# Altium schematic sheet Processor.SchDoc
size A4
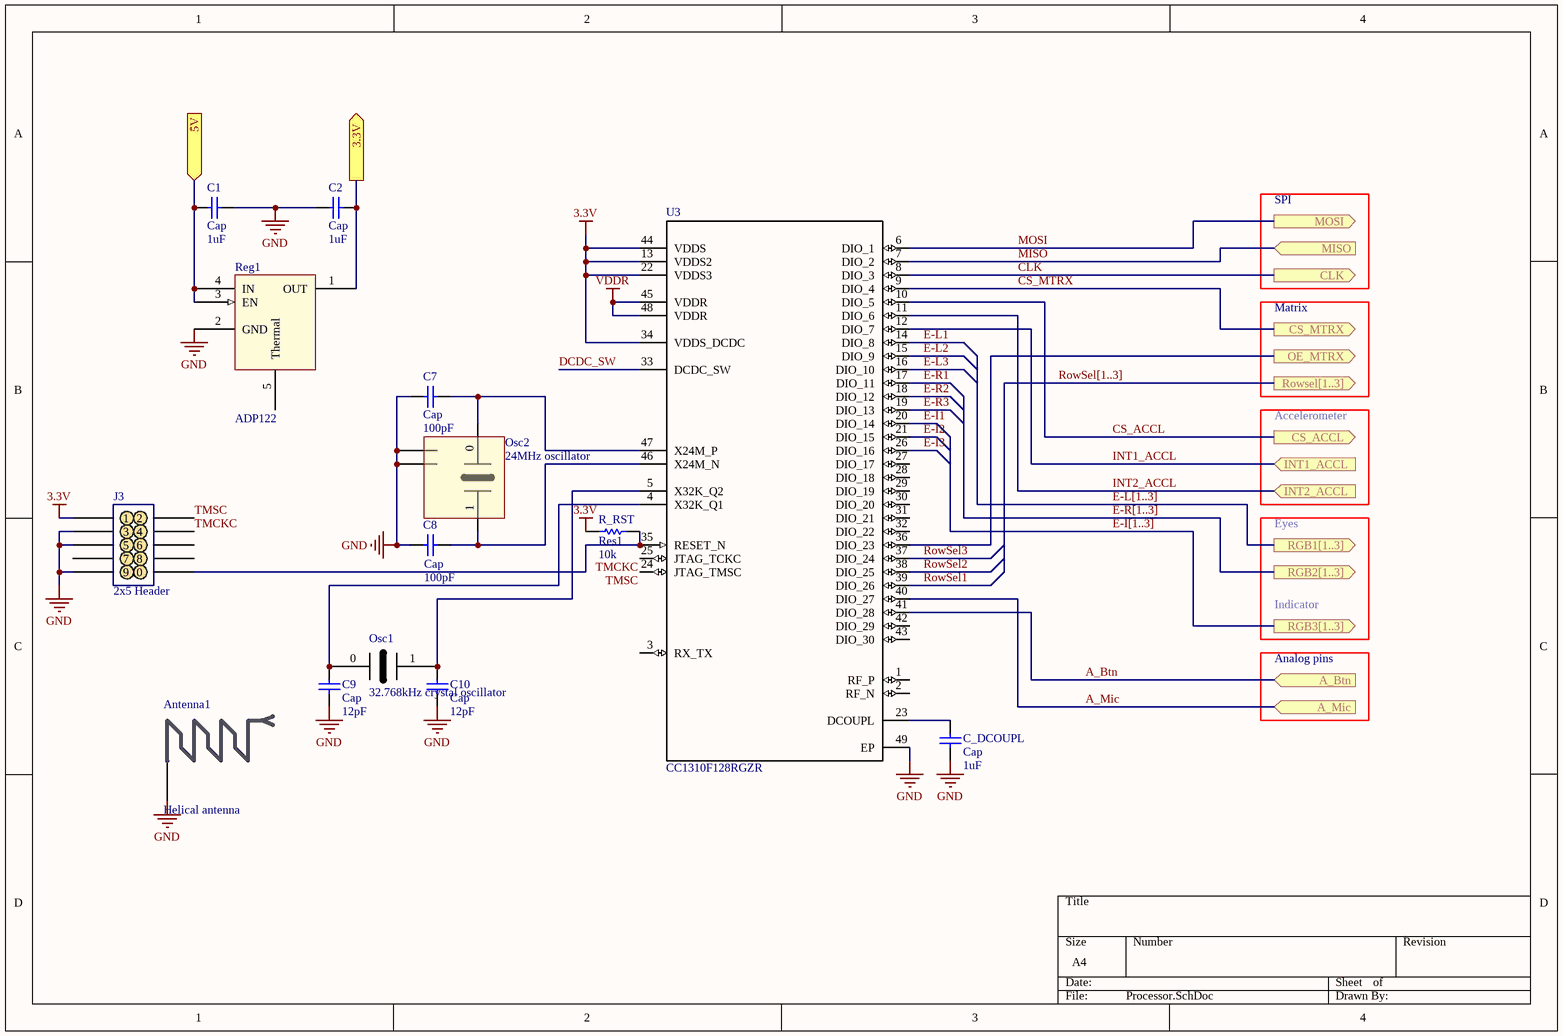
[diagram p0: Processor.SchDoc]

## Parts
Antenna1  Helical antenna  [ANTENNA_HELICAL]
C1  Cap  value 1uF  [6-0805_M]
C2  Cap  value 1uF  [6-0805_M]
C7  Cap  value 100pF  [6-0805_M]
C8  Cap  value 100pF  [6-0805_M]
C9  Cap  value 12pF  [6-0805_M]
C10  Cap  value 12pF  [6-0805_M]
C_DCOUPL  Cap  value 1uF  [6-0805_M]
J3  2x5 Header  [2x5_1.27mm]
Osc1  32.768kHz crystal oscillator  [32kHz_osc]
Osc2  24MHz oscillator  [24MHz_Osc]
R_RST  Res1  value 10k  [6-0805_M]
Reg1  ADP122  [SOP5]
U3  CC1310F128RGZR  [CC1310RGZ]

## Ports
3.3V (out), 5V (in), A_Btn (in), A_Mic (in), CLK (out), CS_ACCL (out), CS_MTRX (out), INT1_ACCL (in), INT2_ACCL (in), MISO (in), MOSI (out), OE_MTRX (out), RGB1[1..3] (out), RGB2[1..3] (out), RGB3[1..3] (out), Rowsel[1..3] (out)

## Nets
3.3V: J3.1 R_RST.1 U3.13(VDDS2) U3.22(VDDS3) U3.34(VDDS_DCDC) U3.44(VDDS)
GND: Antenna1.0(CON) C1.1 C2.2 C7.2 C8.1 C9.1 C10.1 C_DCOUPL.1 J3.3 J3.5 J3.9 Osc2.2 Osc2.3 Reg1.2(GND) U3.49(EP)
VDDR: U3.45(VDDR) U3.48(VDDR)
3.3V: C2.1 Reg1.1(OUT) ; port 3.3V  [a separate net that carries the same name]
5V: C1.2 Reg1.3(EN) Reg1.4(IN) ; port 5V
A_Btn: U3.41(DIO_28) ; port A_Btn
A_Mic: U3.40(DIO_27) ; port A_Mic
CLK: U3.8(DIO_3) ; port CLK
CS_ACCL: U3.10(DIO_5) ; port CS_ACCL
CS_MTRX: U3.9(DIO_4) ; port CS_MTRX
DCDC_SW: U3.33(DCDC_SW)
E-I1: U3.20(DIO_14)
E-I2: U3.21(DIO_15)
E-I3: U3.26(DIO_16)
E-L1: U3.14(DIO_8)
E-L2: U3.15(DIO_9)
E-L3: U3.16(DIO_10)
E-R1: U3.17(DIO_11)
E-R2: U3.18(DIO_12)
E-R3: U3.19(DIO_13)
INT1_ACCL: U3.12(DIO_7) ; port INT1_ACCL
INT2_ACCL: U3.11(DIO_6) ; port INT2_ACCL
MISO: U3.7(DIO_2) ; port MISO
MOSI: U3.6(DIO_1) ; port MOSI
OE_MTRX: U3.36(DIO_23) ; port OE_MTRX
RowSel1: U3.39(DIO_26)
RowSel2: U3.38(DIO_25)
RowSel3: U3.37(DIO_24)
TMCKC: J3.4 U3.25(JTAG_TCKC)
TMSC: J3.2 U3.24(JTAG_TMSC)
NetC7_1: C7.1 Osc2.0 U3.47(X24M_P)
NetC8_2: C8.2 Osc2.1 U3.46(X24M_N)
NetC9_2: C9.2 Osc1.0 U3.4(X32K_Q1)
NetC10_2: C10.2 Osc1.1 U3.5(X32K_Q2)
NetC_DCOUPL_2: C_DCOUPL.2 U3.23(DCOUPL)
NetJ3_10: J3.10 R_RST.2 U3.35(RESET_N)

Not connected (* = marked no-connect by the designer): J3 6 7 8; Reg1 5(Thermal); U3 1(RF_P) 2(RF_N) 3(RX_TX) 27(DIO_17) 28(DIO_18) 29(DIO_19) 30(DIO_20) 31(DIO_21) 32(DIO_22) 42(DIO_29) 43(DIO_30)

## Buses and harness runs
bus E-I[1..3] = port RGB3[1..3]
bus E-L[1..3] = port RGB1[1..3]
bus E-R[1..3] = port RGB2[1..3]
bus RowSel[1..3] = port Rowsel[1..3]

## Notes on the sheet
- SPI
- Matrix
- Accelerometer
- Eyes
- Indicator
- Analog pins

## Library data of the parts
Antenna1 = ANTENNA_HELICAL
C1 C2 C7-C10 C_DCOUPL = Cap: Capacitor; Published: 8-Jun-2000; LatestRevisionDate: 17-Jul-2002; LatestRevisionNote: Re-released for DXP Platform.; PackageReference: RAD-0.3; Publisher: Altium Limited; PackageDescription: Radial Cap, Thru-Hole; 2 Leads; 0.3 in Pin Spacing
J3 = 2x5 Header 1.27mm SMD: 2x5 1.27mm pitch SMD header
Osc1 = OSC32
Osc2 = Osc_24M
R_RST = Res1: Resistor; Published: 8-Jun-2000; LatestRevisionDate: 17-Jul-2002; LatestRevisionNote: Re-released for DXP Platform.; PackageReference: AXIAL-0.3; Publisher: Altium Limited; PackageDescription: Axial Device, Thru-Hole; 2 Leads; 0.3 in Pin Spacing
Reg1 = REG: LD59030DTPU33R 3.3V regulator; pin to pad: 1>5 4>1 5>4
U3 = CC1310F128RGZR: Imported; Alternate_PartNumber: CC1310F128RGZT; Manufacturer: Texas Instruments; CompType: IC; PIN_COUNT: 49; Application_BuildNumber: *; PartNumber: CC1310F128RGZR; PackageReference: RGZ0048A; MountType: SMT; RefDes: RefDes; TYPE: TYPE; Value: Value